# Altium schematic sheet GPACConnector.SchDoc: GPAC Connector
size A4; Author: H.Krüger; DrawnBy: H.Krüger; Organization: SILAB; Address1: Physikalisches Institut; Address2: Universität Bonn; Address3: Nußallee 12; Address4: 53115 Bonn; Revision: 1.1; SheetNumber: 2; SheetTotal: 2; Project: XTB01 Carrier
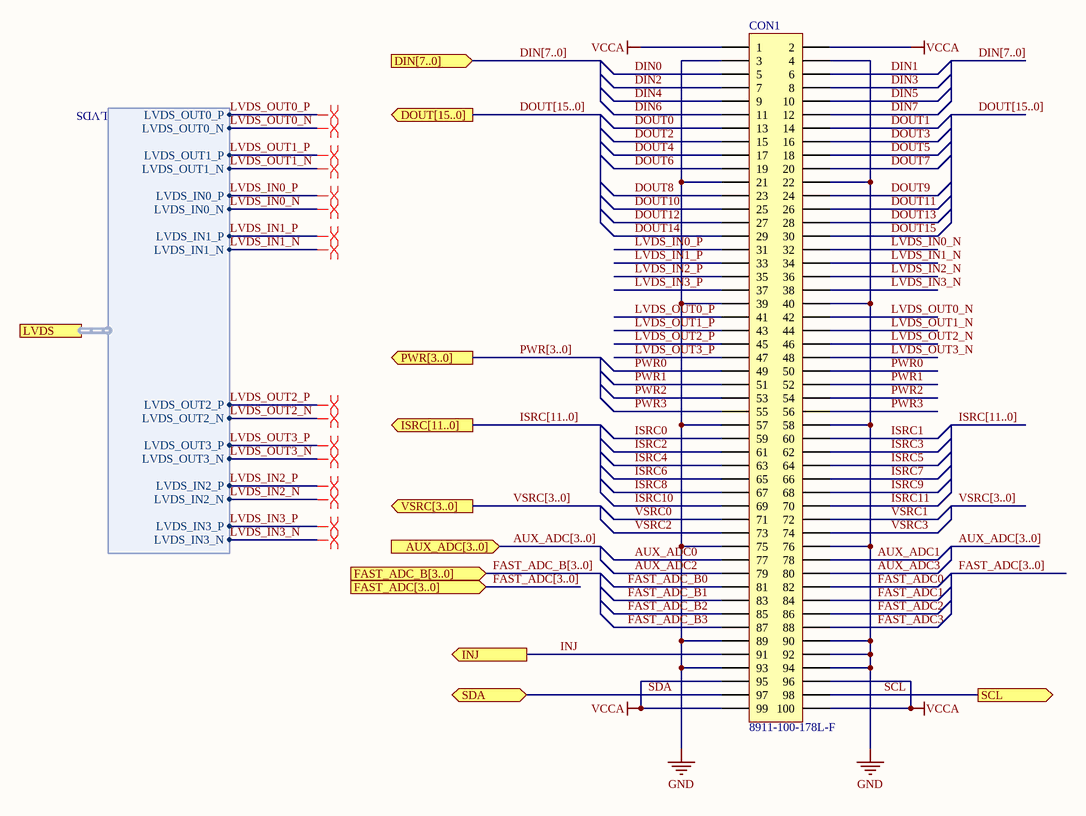
[diagram p0: GPACConnector.SchDoc]

## Parts
CON1  Type_1: 8911-100-178L-F  [KEL 8911-100-178L-F, PLUG]  (hidden comment: -)

## Ports
AUX_ADC[3..0] (in), DIN[7..0] (in), DOUT[15..0] (out), FAST_ADC[3..0] (in), FAST_ADC_B[3..0] (in), INJ (out), ISRC[11..0] (out), LVDS (harness LVDS), PWR[3..0] (out), SCL (out), SDA (bidir), VSRC[3..0] (out)

## Harnesses
LVDS: LVDS_IN0_P, LVDS_IN0_N, LVDS_IN1_P, LVDS_IN1_N, LVDS_OUT0_P, LVDS_OUT0_N, LVDS_OUT1_P, LVDS_OUT1_N, LVDS_IN2_P, LVDS_IN2_N, LVDS_IN3_P, LVDS_IN3_N, LVDS_OUT2_P, LVDS_OUT2_N, LVDS_OUT3_P, LVDS_OUT3_N

## Nets
GND: CON1.3 CON1.4 CON1.21 CON1.22 CON1.39 CON1.40 CON1.57 CON1.58 CON1.75 CON1.76 CON1.89 CON1.90 CON1.92 CON1.93 CON1.94
VCCA: CON1.1 CON1.2 CON1.95 CON1.96 CON1.99 CON1.100
AUX_ADC0: CON1.77
AUX_ADC1: CON1.78
AUX_ADC2: CON1.79
AUX_ADC3: CON1.80
DIN0: CON1.5
DIN1: CON1.6
DIN2: CON1.7
DIN3: CON1.8
DIN4: CON1.9
DIN5: CON1.10
DIN6: CON1.11
DIN7: CON1.12
DOUT0: CON1.13
DOUT1: CON1.14
DOUT2: CON1.15
DOUT3: CON1.16
DOUT4: CON1.17
DOUT5: CON1.18
DOUT6: CON1.19
DOUT7: CON1.20
DOUT8: CON1.23
DOUT9: CON1.24
DOUT10: CON1.25
DOUT11: CON1.26
DOUT12: CON1.27
DOUT13: CON1.28
DOUT14: CON1.29
DOUT15: CON1.30
FAST_ADC0: CON1.82
FAST_ADC1: CON1.84
FAST_ADC2: CON1.86
FAST_ADC3: CON1.88
FAST_ADC_B0: CON1.81
FAST_ADC_B1: CON1.83
FAST_ADC_B2: CON1.85
FAST_ADC_B3: CON1.87
INJ: CON1.91 ; port INJ
ISRC0: CON1.59
ISRC1: CON1.60
ISRC2: CON1.61
ISRC3: CON1.62
ISRC4: CON1.63
ISRC5: CON1.64
ISRC6: CON1.65
ISRC7: CON1.66
ISRC8: CON1.67
ISRC9: CON1.68
ISRC10: CON1.69
ISRC11: CON1.70
LVDS_IN0_N: CON1.32 ; port LVDS.LVDS_IN0_N
LVDS_IN0_P: CON1.31 ; port LVDS.LVDS_IN0_P
LVDS_IN1_N: CON1.34 ; port LVDS.LVDS_IN1_N
LVDS_IN1_P: CON1.33 ; port LVDS.LVDS_IN1_P
LVDS_IN2_N: CON1.36 ; port LVDS.LVDS_IN2_N
LVDS_IN2_P: CON1.35 ; port LVDS.LVDS_IN2_P
LVDS_IN3_N: CON1.38 ; port LVDS.LVDS_IN3_N
LVDS_IN3_P: CON1.37 ; port LVDS.LVDS_IN3_P
LVDS_OUT0_N: CON1.42 ; port LVDS.LVDS_OUT0_N
LVDS_OUT0_P: CON1.41 ; port LVDS.LVDS_OUT0_P
LVDS_OUT1_N: CON1.44 ; port LVDS.LVDS_OUT1_N
LVDS_OUT1_P: CON1.43 ; port LVDS.LVDS_OUT1_P
LVDS_OUT2_N: CON1.46 ; port LVDS.LVDS_OUT2_N
LVDS_OUT2_P: CON1.45 ; port LVDS.LVDS_OUT2_P
LVDS_OUT3_N: CON1.48 ; port LVDS.LVDS_OUT3_N
LVDS_OUT3_P: CON1.47 ; port LVDS.LVDS_OUT3_P
PWR0: CON1.49 CON1.50
PWR1: CON1.51 CON1.52
PWR2: CON1.53 CON1.54
PWR3: CON1.55 CON1.56
SCL: CON1.98 ; port SCL
SDA: CON1.97 ; port SDA
VSRC0: CON1.71
VSRC1: CON1.72
VSRC2: CON1.73
VSRC3: CON1.74

## Buses and harness runs
bus AUX_ADC[3..0]
bus AUX_ADC[3..0] = port AUX_ADC[3..0]
bus DIN[7..0]
bus DIN[7..0] = port DIN[7..0]
bus DOUT[15..0]
bus DOUT[15..0] = port DOUT[15..0]
bus FAST_ADC[3..0]
bus FAST_ADC[3..0] = port FAST_ADC[3..0]
bus FAST_ADC_B[3..0] = port FAST_ADC_B[3..0]
bus ISRC[11..0]
bus ISRC[11..0] = port ISRC[11..0]
bus PWR[3..0] = port PWR[3..0]
bus VSRC[3..0]
bus VSRC[3..0] = port VSRC[3..0]

## Layout directives
differential pair: LVDS_IN0_N, LVDS_IN0_P, LVDS_IN1_N, LVDS_IN1_P, LVDS_IN2_N, LVDS_IN2_P, LVDS_IN3_N, LVDS_IN3_P, LVDS_OUT0_N, LVDS_OUT0_P, LVDS_OUT1_N, LVDS_OUT1_P, LVDS_OUT2_N, LVDS_OUT2_P, LVDS_OUT3_N, LVDS_OUT3_P

## Notes on the sheet
- Title:
- Drawn by:
- Physikalisches Institut
- Universität Bonn
- Project:
- Date:
- File:
- Time:
- Revision:
- Sheet
- of
- Nußallee 12
- 53115 Bonn

## Library data of the parts
CON1 = CON KEL 8911, male: KEL 8911 100 pin board to board connector; Revision: July-2002: Re-released for DXP Platform.; Publisher: Silab J.S.; Class: Connector; Value: -; Constraints: -; HelpURL: http://www.kel.jp/english/product/Half_8900/8900.pdf; LatestRevisionDate:: 24-Sep-2008; Comment_1: KEL; PackageDescription: -